# EAGLE schematic schematic (EAGLE 8.5.2)
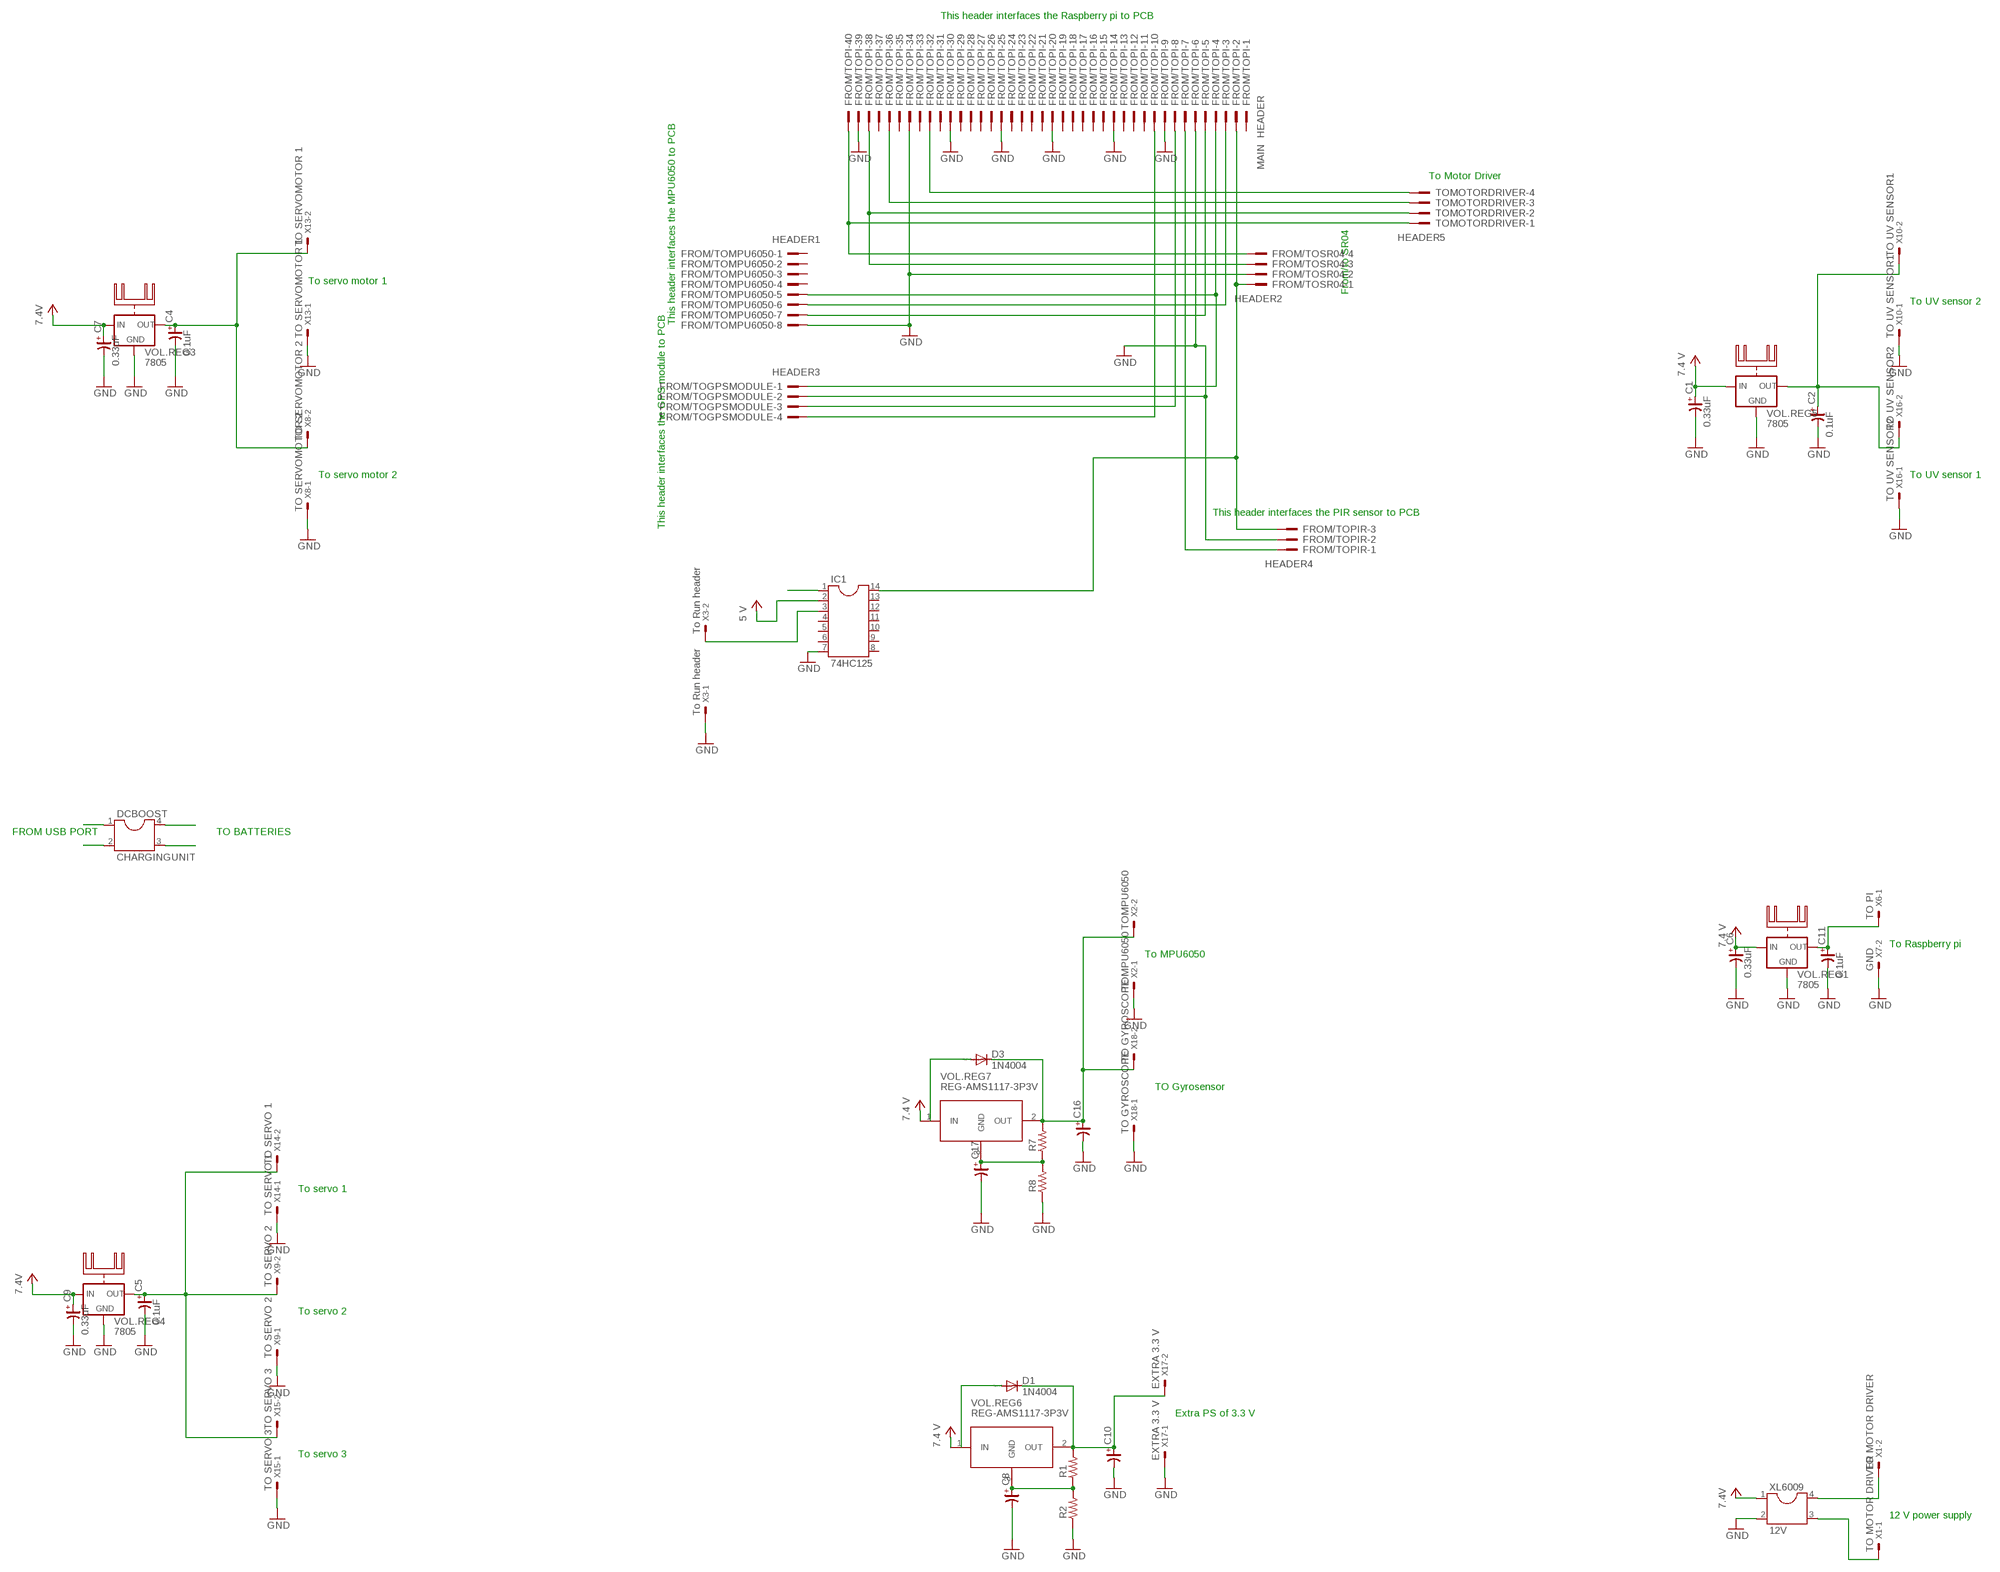
[diagram p0: schematic, sheet 1]

## Parts
C1  0.33uF  CP_3216  [C3216/T]
C2  0.1uF  CP_3216  [C3216/T]
C4  0.1uF  CP_3216  [C3216/T]
C5  0.1uF  CP_3216  [C3216/T]
C6  0.33uF  CP_3216  [C3216/T]
C7  0.33uF  CP_3216  [C3216/T]
C8  CP_3216  [C3216/T]
C9  0.33uF  CP_3216  [C3216/T]
C10  CP_3216  [C3216/T]
C11  0.1uF  CP_3216  [C3216/T]
C16  CP_3216  [C3216/T]
C17  CP_3216  [C3216/T]
D1  1N4004  [DO41-10]
D3  1N4004  [DO41-10]
DCBOOST  CHARGINGUNIT  DIL4  [DIL04]
FROM/TOGPSMODULE  HEADER3  2510-  [PAK100/2500-10]
FROM/TOMPU6050  HEADER1  2510-  [PAK100/2500-10]
FROM/TOPI  MAIN HEADER  2540-5  [PAK100/2500-5-40]
FROM/TOPIR  HEADER4  2510-  [PAK100/2500-10]
FROM/TOSR04  HEADER2  2510-  [PAK100/2500-10]
IC1  74HC125  DIL14  [DIL14]
R1  R_0201  [R0201]
R2  R_0201  [R0201]
R7  R_0201  [R0201]
R8  R_0201  [R0201]
TOMOTORDRIVER  HEADER5  2510-  [PAK100/2500-10]
VOL.REG1  7805  78XXH  [78XXH]
VOL.REG3  7805  78XXH  [78XXH]
VOL.REG4  7805  78XXH  [78XXH]
VOL.REG5  7805  78XXH  [78XXH]
VOL.REG6  REG-AMS1117-3P3V  REG-AMS1117-3P-3.3V  [REG-AMS1117-3P]
VOL.REG7  REG-AMS1117-3P3V  REG-AMS1117-3P-3.3V  [REG-AMS1117-3P]
X1  TO MOTOR DRIVER  332-02  [332-02]
X2  TOMPU6050  332-02  [332-02]
X3  To Run header  332-02  [332-02]
X6  TO PI  332-02  [332-02]
X7  GND  332-02  [332-02]
X8  TO SERVOMOTOR 2  332-02  [332-02]
X9  TO SERVO 2  332-02  [332-02]
X10  TO UV SENSOR1  332-02  [332-02]
X13  TO SERVOMOTOR 1  332-02  [332-02]
X14  TO SERVO 1  332-02  [332-02]
X15  TO SERVO 3  332-02  [332-02]
X16  TO UV SENSOR2  332-02  [332-02]
X17  EXTRA 3.3 V  332-02  [332-02]
X18  TO GYROSCOPE  332-02  [332-02]
XL6009  12V  DIL4  [DIL04]

## Nets
+3V3: C1.+ C6.+ C7.+ C9.+ IC1.2 VOL.REG1.IN VOL.REG3.IN VOL.REG4.IN VOL.REG5.IN VOL.REG6.1(IN) VOL.REG7.1(IN) XL6009.1 ; supply symbol labelled 7.4 V, 7.4V, 5 V
GND: C1.- C2.- C4.- C5.- C6.- C7.- C8.- C9.- C10.- C11.- C16.- C17.- FROM/TOGPSMODULE.2 FROM/TOMPU6050.8 FROM/TOPI.6 FROM/TOPI.9 FROM/TOPI.14 FROM/TOPI.20 FROM/TOPI.25 FROM/TOPI.30 FROM/TOPI.34 FROM/TOPI.39 FROM/TOPIR.2 FROM/TOSR04.2 IC1.7 R2.1 R8.1 VOL.REG1.GND VOL.REG3.GND VOL.REG4.GND VOL.REG5.GND X2.1 X3.1 X7.2 X8.1 X9.1 X10.1 X13.1 X14.1 X15.1 X16.1 X17.1 X18.1 XL6009.2
N$1: DCBOOST.3
N$2: FROM/TOPI.32 TOMOTORDRIVER.4
N$3: X1.2 XL6009.4
N$4: DCBOOST.1
N$5: C2.+ VOL.REG5.OUT X10.2 X16.2
N$6: C8.+ R1.1 R2.2 VOL.REG6.3(GND)
N$7: D1.A
N$8: IC1.1
N$9: C11.+ VOL.REG1.OUT X6.1
N$10: FROM/TOPI.36 TOMOTORDRIVER.3
N$11: IC1.3 X3.2
N$12: DCBOOST.2
N$13: DCBOOST.4
N$14: C5.+ VOL.REG4.OUT X9.2 X14.2 X15.2
N$15: X13.2
N$16: C10.+ D1.C R1.2 VOL.REG6.2(OUT) X17.2
N$17: C4.+ VOL.REG3.OUT X8.2
N$18: FROM/TOGPSMODULE.1 FROM/TOMPU6050.5 FROM/TOPI.4
N$19: FROM/TOMPU6050.6 FROM/TOPI.3
N$20: FROM/TOMPU6050.7 FROM/TOPI.5
N$22: FROM/TOPI.40 FROM/TOSR04.4 TOMOTORDRIVER.1
N$23: C17.+ R7.1 R8.2 VOL.REG7.3(GND)
N$24: C16.+ D3.C R7.2 VOL.REG7.2(OUT) X2.2 X18.2
N$25: D3.A
N$26: FROM/TOPI.38 FROM/TOSR04.3 TOMOTORDRIVER.2
N$27: FROM/TOPI.2 FROM/TOPIR.3 FROM/TOSR04.1 IC1.14
N$29: FROM/TOGPSMODULE.3 FROM/TOPI.8
N$30: FROM/TOGPSMODULE.4 FROM/TOPI.10
N$31: FROM/TOPI.7 FROM/TOPIR.1
N$32: X1.1 XL6009.3
Unconnected: FROM/TOGPSMODULE.5 FROM/TOGPSMODULE.6 FROM/TOGPSMODULE.7 FROM/TOGPSMODULE.8 FROM/TOGPSMODULE.9 FROM/TOGPSMODULE.10 FROM/TOMPU6050.1 FROM/TOMPU6050.2 FROM/TOMPU6050.3 FROM/TOMPU6050.4 FROM/TOMPU6050.9 FROM/TOMPU6050.10 FROM/TOPI.1 FROM/TOPI.11 FROM/TOPI.12 FROM/TOPI.13 FROM/TOPI.15 FROM/TOPI.16 FROM/TOPI.17 FROM/TOPI.18 FROM/TOPI.19 FROM/TOPI.21 FROM/TOPI.22 FROM/TOPI.23 FROM/TOPI.24 FROM/TOPI.26 FROM/TOPI.27 FROM/TOPI.28 FROM/TOPI.29 FROM/TOPI.31 FROM/TOPI.33 FROM/TOPI.35 FROM/TOPI.37 FROM/TOPIR.4 FROM/TOPIR.5 FROM/TOPIR.6 FROM/TOPIR.7 FROM/TOPIR.8 FROM/TOPIR.9 FROM/TOPIR.10 FROM/TOSR04.5 FROM/TOSR04.6 FROM/TOSR04.7 FROM/TOSR04.8 FROM/TOSR04.9 FROM/TOSR04.10 IC1.4 IC1.5 IC1.6 IC1.8 IC1.9 IC1.10 IC1.11 IC1.12 IC1.13 TOMOTORDRIVER.5 TOMOTORDRIVER.6 TOMOTORDRIVER.7 TOMOTORDRIVER.8 TOMOTORDRIVER.9 TOMOTORDRIVER.10 X6.2 X7.1

## Notes on the sheet
- This header interfaces the Raspberry pi to PCB
- To Motor Driver
- To servo motor 1
- From/to SR04
- To UV sensor 2
- This header interfaces the MPU6050 to PCB
- To servo motor 2 | To UV sensor 1
- This header interfaces the PIR sensor to PCB
- This header interfaces the GPS module to PCB
- FROM USB PORT | TO BATTERIES
- To Raspberry pi
- To MPU6050
- TO Gyrosensor
- To servo 1
- To servo 2
- Extra PS of 3.3 V
- To servo 3
- 12 V power supply

## Library data of the parts
C1 C2 C4-C11 C16 C17 = rc-master-smd:CP_: POLARIZED CAP
D1 D3 = diode:1N4004: DIODE general purpose rectifier, 1 A
DCBOOST XL6009 = ic-package:DIL4: Dual In Line / Socket
FROM/TOGPSMODULE FROM/TOMPU6050 FROM/TOPIR FROM/TOSR04 TOMOTORDRIVER = con-3m:2510-: 3M (TM) Pak 100 4-Wall Header Source: 3M; MF: 3M; MPN: 2510-6002UB; OC_FARNELL: 9838244; OC_NEWARK: 46F4725
FROM/TOPI = con-3m:2540-: 3M (TM) Pak 100 4-Wall Header Source: 3M; OC_FARNELL: 9838414; OC_NEWARK: unknown
IC1 = ic-package:DIL14: Dual In Line / Socket
R1 R2 R7 R8 = rc-master-smd:R_: RESISTOR
VOL.REG1 VOL.REG3-VOL.REG5 = 78xx_with_heatsink:78XXH: VOLTAGE REGULATOR
VOL.REG6 VOL.REG7 = diy-modules:REG-AMS1117-3P-*: Linear Regulator based on AMS1117 chip 3-pin version AMS1117 datasheet is available here: http://www.advanced-monolithic.com/pdf/ds1117.pdf Click here to find device on ebay.com <http://www.ebay.com/sch/ams1117+module> Note: There are many variants. Search for the proper version.
X1-X3 X6-X10 X13-X18 = con-garry:332-02: 2 Pin - 2mm Dual Row Source: www.mpe-connector.de / garry_shortform_2012.pdf